# Altium schematic sheet 08_RADAR_INTERFACE.SchDoc: =TitleParameter
size A3; Address: Crete IL; Organization: ASISGUARD; Address1: Kemalpasa, Kemalpasa Cd. No:290 D:292H, 35060 Bornova/Izmir/Turkey
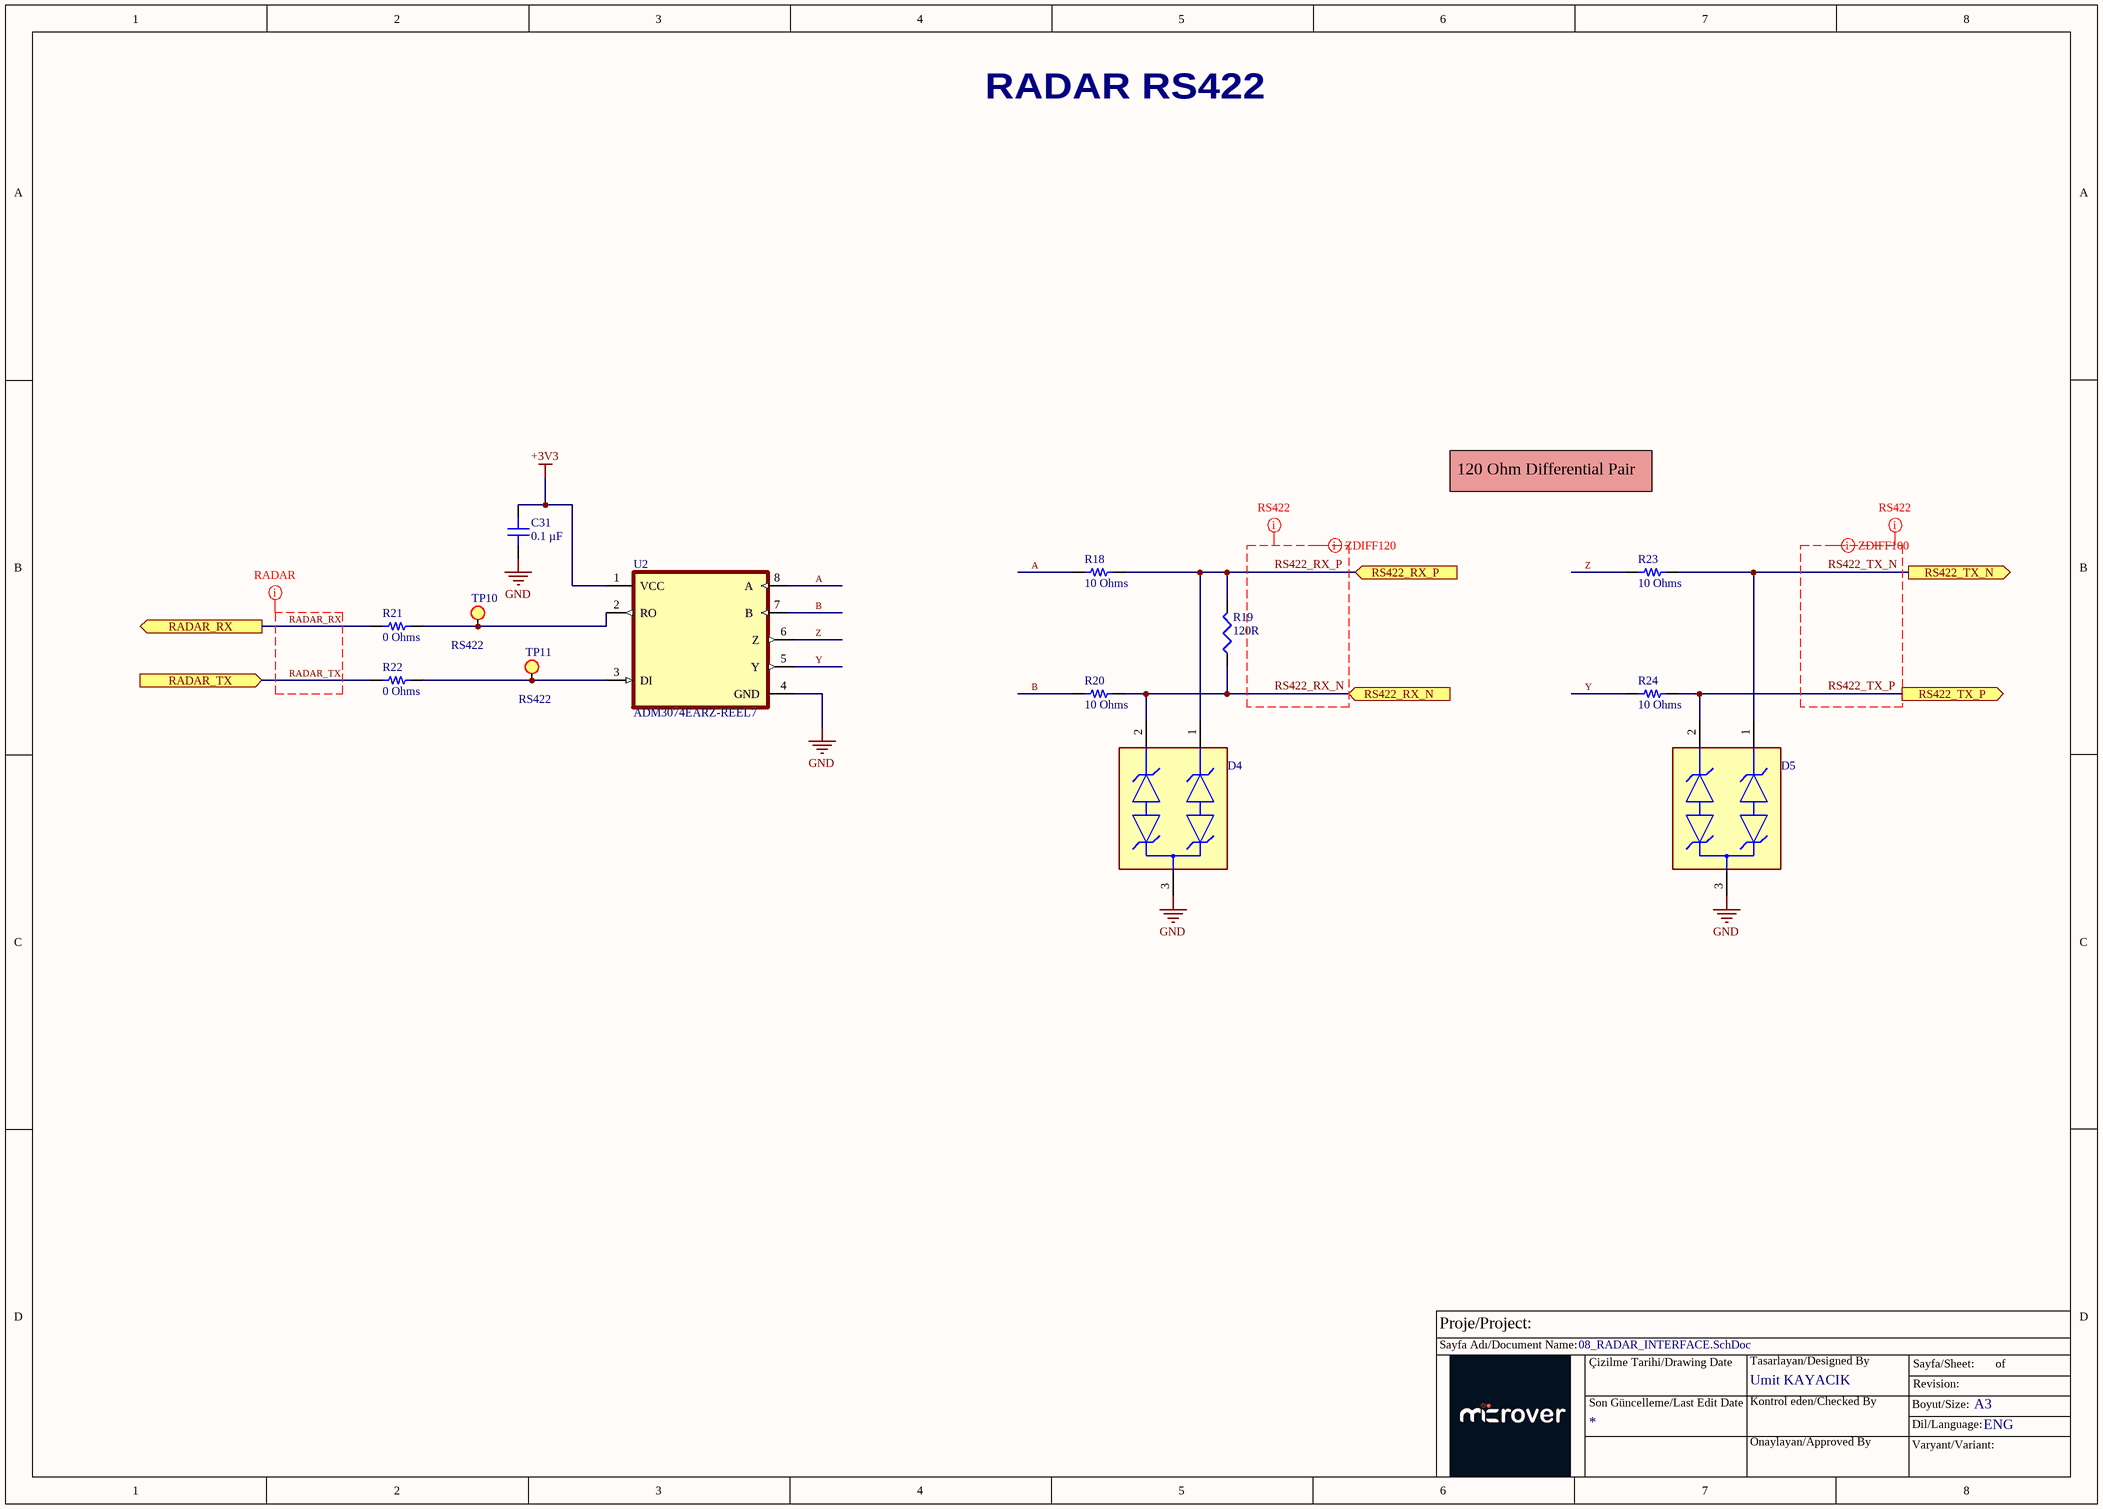
[diagram p0: 08_RADAR_INTERFACE.SchDoc]

## Parts
C31  0.1 µF  [CAP 0603_1608]
D4  SM712-02HTG  [Littelfuse_SM712_MFG]  (value not drawn)
D5  SM712-02HTG  [Littelfuse_SM712_MFG]  (value not drawn)
R18  10 Ohms  [RES 0603_1608]
R19  value 120R  [RES1206]  (hidden comment: RES SMD 120 OHM 1% 1/2W 1206)
R20  10 Ohms  [RES 0603_1608]
R21  0 Ohms  [RES 0402_1005]
R22  0 Ohms  [RES 0402_1005]
R23  10 Ohms  [RES 0603_1608]
R24  10 Ohms  [RES 0603_1608]
TP10  RS422  [TEST_POINT]
TP11  RS422  [TEST_POINT]
U2  ADM3074EARZ-REEL7  [SOIC127P600X175-8N]

## Ports
RADAR_RX (out), RADAR_TX (in), RS422_RX_N (in), RS422_RX_P (in), RS422_TX_N (out), RS422_TX_P (out)

## Nets
+3V3: C31.2 U2.1(VCC)
GND: C31.1 D4.3 D5.3 U2.4(GND)
A: R18.1 U2.8(A)
B: R20.1 U2.7(B)
RADAR_RX: R21.2 ; port RADAR_RX
RADAR_TX: R22.2 ; port RADAR_TX
RS422_RX_N: D4.2 R19.1 R20.2 ; port RS422_RX_N
RS422_RX_P: D4.1 R18.2 R19.2 ; port RS422_RX_P
RS422_TX_N: D5.1 R23.2 ; port RS422_TX_N
RS422_TX_P: D5.2 R24.2 ; port RS422_TX_P
Y: R24.1 U2.5(Y)
Z: R23.1 U2.6(Z)
NetR21_1: R21.1 TP10.1(TP) U2.2(RO)
NetR22_1: R22.1 TP11.1(TP) U2.3(DI)

## Layout directives
net class RS422: RS422_RX_N, RS422_RX_P, RS422_TX_N, RS422_TX_P
net class RADAR: RADAR_RX, RADAR_TX
differential pair; differential pair class ZDIFF120: RS422_RX_N, RS422_RX_P, RS422_TX_N, RS422_TX_P

## Notes on the sheet
- RADAR RS422
- 120 Ohm Differential Pair
- Proje/Project:
- Sayfa Adı/Document Name:
- Çizilme Tarihi/Drawing Date
- Umit KAYACIK
- Tasarlayan/Designed By
- Sayfa/Sheet:
- Revision:
- of
- Son Güncelleme/Last Edit Date
- Kontrol eden/Checked By
- Onaylayan/Approved By
- Boyut/Size:
- Varyant/Variant:
- Dil/Language:
- A3
- ENG

## Library data of the parts
C31 = VJ0603Y104KXAPW1BC: CAP CER 0.1UF 50V X7R 0603; manufacturer: Vishay Vitramon; Tolerance: ±10%; Part Number: VJ0603Y104KXAPW1BC; Value: 0.1 µF; Applications: General Purpose; Capacitance: 0.1 µF; componentlink2description: DigiKey Link; componentlink2url: https://www.digikey.com/en/products/detail/vishay-vitramon/VJ0603Y104KXAPW1BC/10670836; Device Package: 0603 (1608 Metric); lastupdated: 2/9/2024 8:09:50 PM; Lifecycle Status: Active; Minimum Order: 1; Mounting Type: Surface Mount, MLCC; Operating Temperature: -55°C ~ 125°C; Package / Case: 0603 (1608 Metric); packaging: TapeAndReel; partid: 45127; Part Status: Active; price: 0.02; series: VJ W1BC; Size / Dimension: 0.063" L x 0.031" W (1.60mm x 0.80mm); Supplier 1: DigiKey; Supplier Part Number 1: 720-VJ0603Y104KXAPW1BCCT-ND; Temperature Coefficient: X7R; Thickness (Max): 0.037" (0.95mm); Voltage - Rated: 50V
R18 R20 R23 R24 = ERJ-PA3F10R0V: RES SMD 10 OHM 1% 1/3W 0603; Manufacturer: Panasonic Electronic Components; Power (Watts): 0.333W, 1/3W; Temperature Coefficient: ±100ppm/°C; Part Number: ERJ-PA3F10R0V; Value: 10 Ohms; ComponentLink1Description: Datasheet; ComponentLink1URL: https://industrial.panasonic.com/cdbs/www-data/pdf/RDO0000/AOA0000C331.pdf; ComponentLink2Description: DigiKey Link; ComponentLink2URL: https://www.digikey.com/en/products/detail/panasonic-electronic-components/ERJ-PA3F10R0V/5035852; Composition: Thick Film; Device Package: 0603 (1608 Metric); Features: Automotive AEC-Q200, Pulse Withstanding; Height - Seated (Max): 0.022" (0.55mm); LastUpdated: 2/9/2024 8:43:35 PM; Lifecycle Status: Active; Minimum Order: 1; Number of Terminations: 2; Operating Temperature: -55°C ~ 155°C; Package / Case: 0603 (1608 Metric); Packaging: TapeAndReel; PartId: 5368; Part Status: Active; Price: 0.01; Ratings: AEC-Q200; Resistance: 10 Ohms; Series: ERJ-PA3; Size / Dimension: 0.063" L x 0.031" W (1.60mm x 0.80mm); Supplier 1: DigiKey; Supplier Part Number 1: P10.00BYCT-ND; Supplier Device Package: 0603; Tolerance: ±1%
R19 = RES1206_120R_%1: 120 Ohms ±1% 0.5W, 1/2W Chip Resistor 1206 (3216 Metric) Thick Film; Manufacturer Part Number: CRGH1206F120R; Order Code: Digi: A129547TR-ND; Sirius Stock Code: *
R21 R22 = HCJ0402ZT0R00: RES 0 OHM JUMPER 1/8W 0402; Manufacturer: Stackpole Electronics Inc; Power (Watts): 0.125W, 1/8W; Part Number: HCJ0402ZT0R00; Value: 0 Ohms; ComponentLink1Description: Datasheet; ComponentLink1URL: https://www.seielect.com/catalog/sei-hcj.pdf; ComponentLink2Description: DigiKey Link; ComponentLink2URL: https://www.digikey.com/en/products/detail/stackpole-electronics-inc/HCJ0402ZT0R00/4357659; Composition: Metal Foil; Device Package: 0402 (1005 Metric); Features: Automotive AEC-Q200; Height - Seated (Max): 0.018" (0.45mm); LastUpdated: 2/9/2024 8:29:49 PM; Lifecycle Status: Active; Minimum Order: 1; Number of Terminations: 2; Operating Temperature: -55°C ~ 155°C; Package / Case: 0402 (1005 Metric); Packaging: TapeAndReel; PartId: 12327; Part Status: Active; Price: 0.07; Ratings: AEC-Q200; Resistance: 0 Ohms; Series: HCJ; Size / Dimension: 0.039" L x 0.020" W (1.00mm x 0.50mm); Supplier 1: DigiKey; Supplier Part Number 1: HCJ0402ZT0R00CT-ND; Supplier Device Package: 0402; Tolerance: Jumper
TP10 TP11 = TP_1
U2 = ADM3074EARZ-REEL7: Single Transmitter/Receiver RS-422/RS-485 8-Pin SOIC N T/R; Manufacturer: Analog Devices; Data Rate: 500Kbps; Number of Receivers: 1; Operating Supply Voltage: 3.3V; Min Supply Voltage: 3V; Max Supply Voltage: 3.6V; Operating Supply Current: 1.5mA; Simplex/Duplex: Full Duplex; Receiver Hysteresis: 100mV; Supplier 1: Digikey; Manufacturer Part Number: ADM3074EARZ-REEL7; RoHS: Yes; Category: RS-232 / RS-422 / RS-485 Interface ICs; Stock 1: 725; Pricing 1: 1=5.83, 10=5.24, 25=4.954, 100=4.2935, 250=4.07332, 500=3.65498 (USD); Mount: Surface Mount; Case/Package: SOIC; Number of Pins: 8; Min Operating Temperature: -40°C; Max Operating Temperature: 125°C; Packaging: Tape and Reel; Package Quantity: 1000; Number of Transmitters: 1; Logic Function: Receiver; Number of Drivers: 1; Number of Transceivers: 1; Series: -; Supply Current: 1.5mA; Lead Free: Contains Lead; RoHS Compliant: Yes; ComponentLink1URL: http://www.mouser.com/ds/2/609/ADM3070E_3071E_3072E_3073E_3074E_3075E_3076E_3077E-878687.pdf?src-supplier=Mouser; ComponentLink1Description: http://www.mouser.com/ds/2/609/ADM3070E_3071E_3072E_3073E_3074E_3075E_3076E_3077E-878687.pdf?src-supplier=Mouser; ComponentLink2URL: http://components.arrow.com/part/dataview/43007547S8418233N2771?src-supplier=Arrow+Electronics; ComponentLink2Description: http://components.arrow.com/part/dataview/43007547S8418233N2771?src-supplier=Arrow+Electronics; ComponentLink3URL: http://www.analog.com/static/imported-files/data_sheets/ADM3070E_3071E_3072E_3073E_3074E_3075E_3076E_3077E_3078E.pdf?src-supplier=Avnet; ComponentLink3Description: http://www.analog.com/static/imported-files/data_sheets/ADM3070E_3071E_3072E_3073E_3074E_3075E_3076E_3077E_3078E.pdf?src-supplier=Avnet; ComponentLink4URL: http://www.analog.com/media/en/technical-documentation/data-sheets/ADM3070E_3071E_3072E_3073E_3074E_3075E_3076E_3077E_3078E.pdf?src-supplier=Digikey; ComponentLink4Description: http://www.analog.com/media/en/technical-documentation/data-sheets/ADM3070E_3071E_3072E_3073E_3074E_3075E_3076E_3077E_3078E.pdf?src-supplier=Digikey; Supplier Part Number 1: 505-ADM3074EARZ-REEL7CT-ND
D4 D5 = SM712-02HTG: Manufacturer Part Number: SM712-02HTG